# EasyEDA schematic ESP-Light-Controller_2020-12-21_12-57-52.json
TITLE: ESP32 5050 LED STRIP CONTROLLER; REV: 1.0; Date: 2020-12-20; Sheet: 1/1; Drawn By: Hassan F
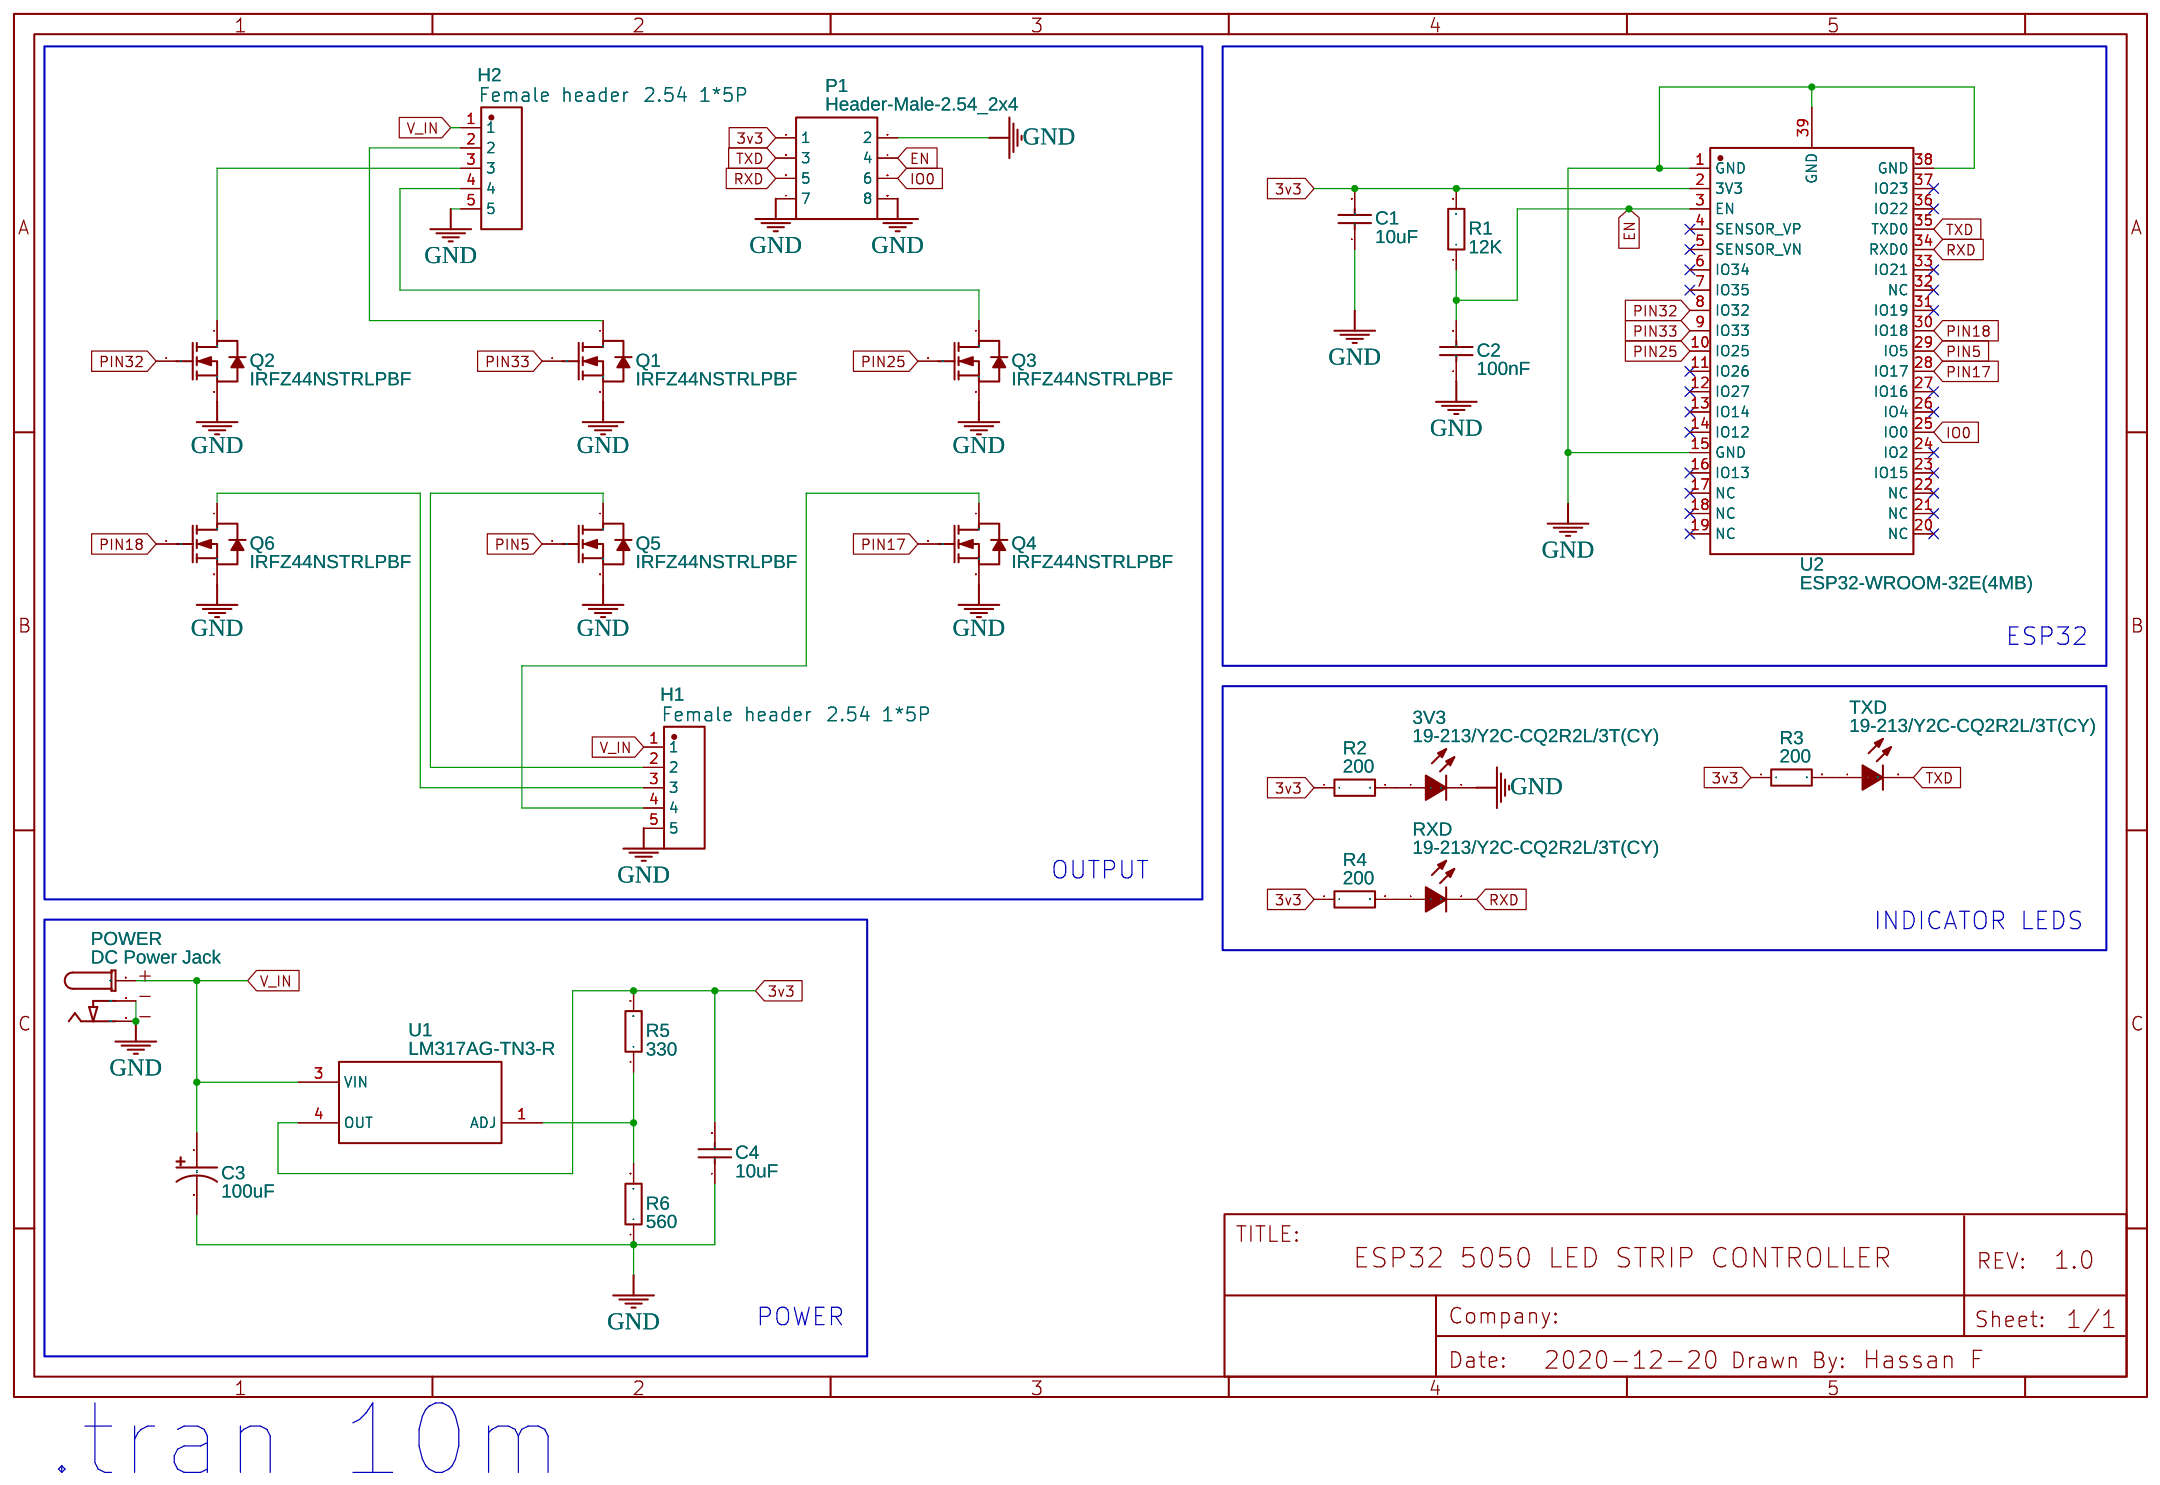
[diagram p0: schematic sheet]

## Parts
3V3  19-213/Y2C-CQ2R2L/3T(CY)  [LED0603-R-RD]
C1  10uF  [C0402]
C2  100nF  [C0402]
C3  100uF  [CAP-SMD_BD6.3-L6.6-W6.6-FD]
C4  10uF  [C0402]
H1  Female header　2.54 1*5Ｐ  [HDR-TH_5P-P2.54-V]
H2  Female header　2.54 1*5Ｐ  [HDR-TH_5P-P2.54-V]
P1  Header-Male-2.54_2x4  [HDR-TH_8P-P2.54-V-M-R2-C4-S2.54]
POWER  DC Power Jack  [PJ-102AH]
Q1  IRFZ44NSTRLPBF  [TO-263-2_L10.0-W9.1-P5.08-LS15.2-TL]
Q2  IRFZ44NSTRLPBF  [TO-263-2_L10.0-W9.1-P5.08-LS15.2-TL]
Q3  IRFZ44NSTRLPBF  [TO-263-2_L10.0-W9.1-P5.08-LS15.2-TL]
Q4  IRFZ44NSTRLPBF  [TO-263-2_L10.0-W9.1-P5.08-LS15.2-TL]
Q5  IRFZ44NSTRLPBF  [TO-263-2_L10.0-W9.1-P5.08-LS15.2-TL]
Q6  IRFZ44NSTRLPBF  [TO-263-2_L10.0-W9.1-P5.08-LS15.2-TL]
R1  12K  [R0402]
R2  200  [R0402]
R3  200  [R0402]
R4  200  [R0402]
R5  330  [R0805]
R6  560  [R0805]
RXD  19-213/Y2C-CQ2R2L/3T(CY)  [LED0603-R-RD]
TXD  19-213/Y2C-CQ2R2L/3T(CY)  [LED0603-R-RD]
U1  LM317AG-TN3-R  [TO-252-2_L6.5-W6.1-P4.58-LS10.0-TL]
U2  ESP32-WROOM-32E(4MB)  [WIFI-SMD_ESP32-WROOM-32E]

## Library data of the parts
3V3 RXD TXD = 19-213/Y2C-CQ2R2L/3T(CY): Supplier: LCSC; Manufacturer: EVERLIGHT; image: //image.lceda.cn/szlcsc/C72038.jpg; Supplier Part: C72038; SMT Type: Basic; JLCPCB SMD: Yes
C1 C4 = CL05A106MQ5NUNC: Supplier: LCSC; Manufacturer: SAMSUNG; Supplier Part: C15525; SMT Type: Basic; JLCPCB SMD: Yes
C2 = CL05B104KO5NNNC: Supplier: LCSC; Manufacturer: SAMSUNG; Supplier Part: C1525; SMT Type: Basic; JLCPCB SMD: Yes
C3 = EEEHA1C101WP: Supplier: LCSC; Manufacturer: PANASONIC; Contributor: LCSC; Supplier Part: C128466
H1 H2 = Female header　2.54 1*5Ｐ: Supplier Part: C46341; Supplier: LCSC; Manufacturer: ReliaPro; image: http://image.lceda.cn/szlcsc/C46341.jpg
P1 = Header-Male-2.54_2x4: Supplier: LCSC; Manufacturer: ReliaPro; Manufacturer Part: Header2X4P 2.54mm; image: http://image.lceda.cn/szlcsc/C58363.jpg; Supplier Part: C58363
POWER = DC Power Jack: Manufacturer: CUI Inc; Supplier: Digi-Key; Supplier Part: CP-102AH-ND; link: https://www.digikey.com/products/en/connectors-interconnects/barrel-power-connectors/435?k=barrel+jack&k=&pkeyword=barrel+jack&sv=0&pv7=17&sf=0&FV=70017d%2C1e880019%2Cffe001b3&quantity=&ColumnSort=1000011&page=1&pageSize=250; Contributor: jettetsoi
Q1-Q6 = IRFZ44NSTRLPBF: Supplier: LCSC; Manufacturer: IR; Supplier Part: C58228; SMT Type: Extend; JLCPCB SMD: Yes
R1 = 0402WGF1202TCE: Supplier: LCSC; Manufacturer: UniOhm; Supplier Part: C25752; SMT Type: Basic; JLCPCB SMD: Yes
R2-R4 = 0402WGF2000TCE: Supplier: LCSC; Manufacturer: UniOhm; Supplier Part: C25087; SMT Type: Basic; JLCPCB SMD: Yes
R5 = ERJP06F3300V: Supplier: LCSC; Supplier Part: C441977; Manufacturer: PANASONIC; Contributor: LCSC
R6 = ERJP06F5600V: Supplier: LCSC; Supplier Part: C441979; Manufacturer: PANASONIC; Contributor: LCSC
U1 = LM317AG-TN3-R: Supplier: LCSC; Manufacturer: UTC; image: //image.lceda.cn/szlcsc/C75510.jpg; Supplier Part: C75510; SMT Type: Basic; JLCPCB SMD: Yes
U2 = ESP32-WROOM-32E(4MB): Supplier: LCSC; Supplier Part: C701341; Manufacturer: Espressif Systems; Contributor: LCSC

## Nets
3v3: C1.2 C4.2 P1.1 R1.2 R2.1 R3.1 R4.1 R5.2 U1.4(OUT) U2.2(3V3)
GND: 3V3.2(C) C1.1 C2.1 C3.2 C4.1 H1.5 H2.5 P1.2 P1.7 P1.8 POWER.P2 POWER.P3 Q1.3(S) Q2.3(S) Q3.3(S) Q4.3(S) Q5.3(S) Q6.3(S) R6.1 U2.1(GND) U2.15(GND) U2.38(GND) U2.39(GND)
EN: C2.2 P1.4 R1.1 U2.3(EN)
IO0: P1.6 U2.25(IO0)
PIN5: Q5.1(G) U2.29(IO5)
PIN17: Q4.1(G) U2.28(IO17)
PIN18: Q6.1(G) U2.30(IO18)
PIN25: Q3.1(G) U2.10(IO25)
PIN32: Q2.1(G) U2.8(IO32)
PIN33: Q1.1(G) U2.9(IO33)
RXD: P1.5 RXD.2(C) U2.34(RXD0)
TXD: P1.3 TXD.2(C) U2.35(TXD0)
V_IN: C3.1 H1.1 H2.1 POWER.P1 U1.3(VIN)
Net-(3V3-1): 3V3.1(A) R2.2
Net-(H1-2): H1.2 Q5.4(D)
Net-(H1-3): H1.3 Q6.4(D)
Net-(H1-4): H1.4 Q4.4(D)
Net-(H2-2): H2.2 Q1.4(D)
Net-(H2-3): H2.3 Q2.4(D)
Net-(H2-4): H2.4 Q3.4(D)
Net-(R3-2): R3.2 TXD.1(A)
Net-(R4-2): R4.2 RXD.1(A)
Net-(R5-1): R5.1 R6.2 U1.1(ADJ)

Not connected (* = marked no-connect by the designer): U2 4(SENSOR_VP)* 5(SENSOR_VN)* 6(IO34)* 7(IO35)* 11(IO26)* 12(IO27)* 13(IO14)* 14(IO12)* 16(IO13)* 17(NC)* 18(NC)* 19(NC)* 20(NC)* 21(NC)* 22(NC)* 23(IO15)* 24(IO2)* 26(IO4)* 27(IO16)* 31(IO19)* 32(NC)* 33(IO21)* 36(IO22)* 37(IO23)*

## Notes on the sheet
- ESP32
- OUTPUT
- INDICATOR LEDS
- POWER
- .tran 10m
